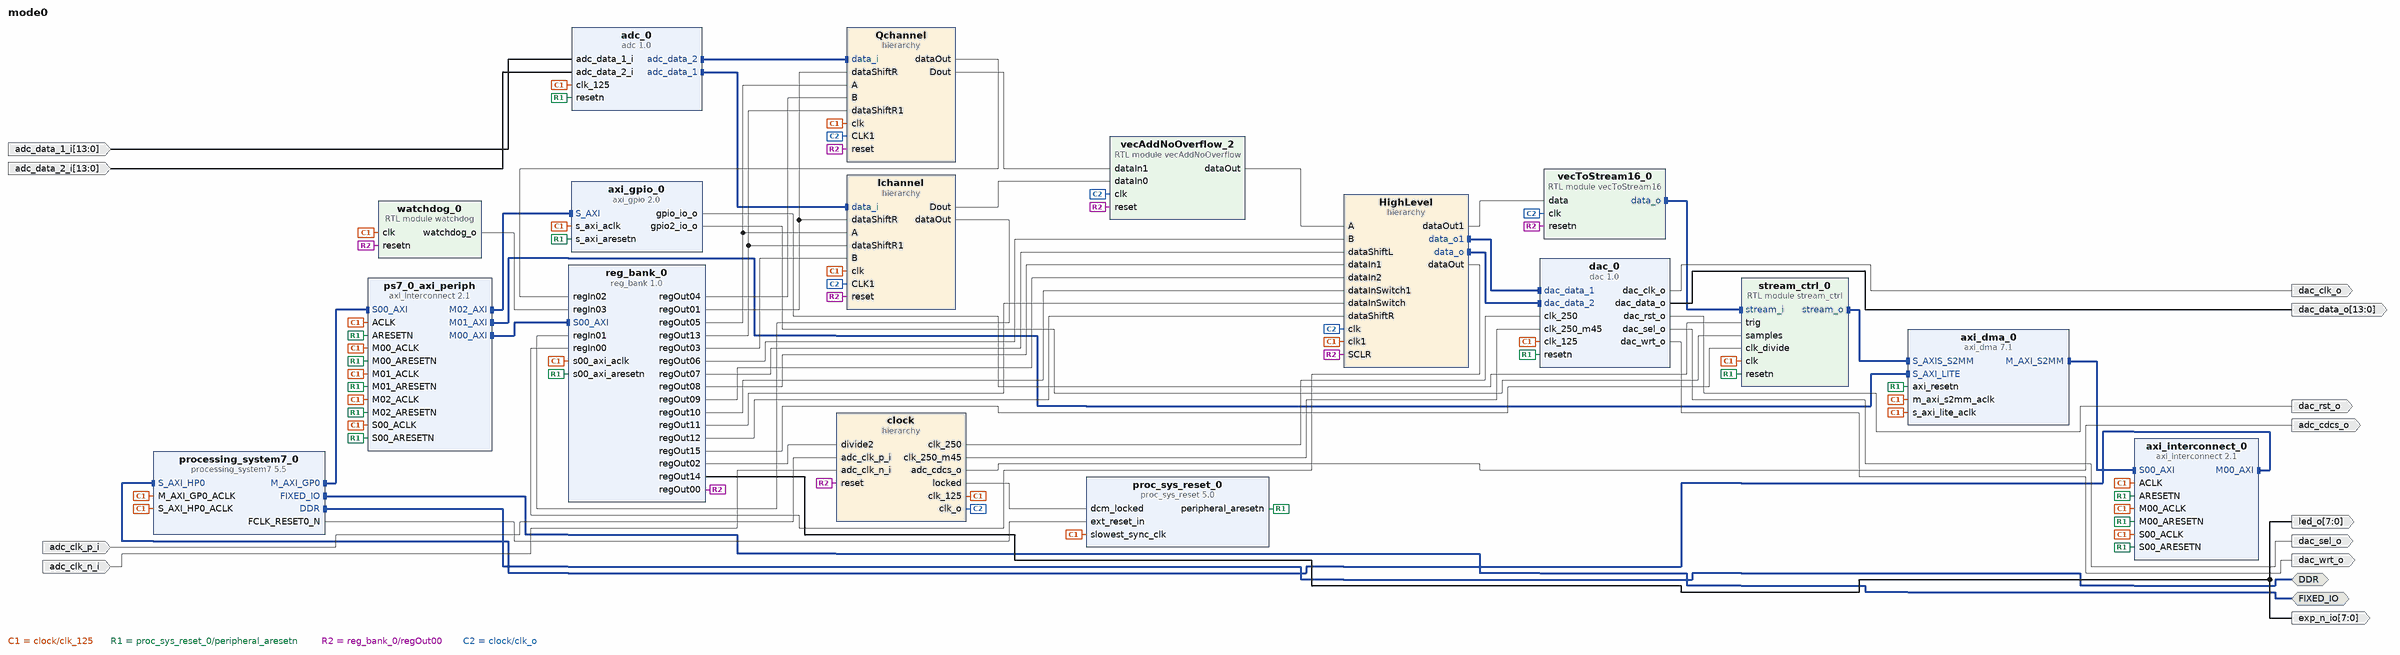
[diagram p0: block diagram of the top level]
# Vivado block design mode0, xc7z010clg400-1, Vivado 2020.2
create_bd_design mode0

create_bd_intf_port -mode Master -vlnv xilinx.com:interface:ddrx_rtl:1.0 DDR
create_bd_intf_port -mode Master -vlnv xilinx.com:display_processing_system7:fixedio_rtl:1.0 FIXED_IO
create_bd_port -dir I adc_clk_n_i
create_bd_port -dir I adc_clk_p_i
create_bd_port -dir I -from 13 -to 0 adc_data_1_i
create_bd_port -dir I -from 13 -to 0 adc_data_2_i
create_bd_port -dir O adc_cdcs_o
create_bd_port -dir O dac_clk_o
create_bd_port -dir O -from 13 -to 0 dac_data_o
create_bd_port -dir O dac_rst_o
create_bd_port -dir O dac_sel_o
create_bd_port -dir O dac_wrt_o
create_bd_port -dir O -from 7 -to 0 exp_n_io
create_bd_port -dir O -from 7 -to 0 led_o

create_bd_cell -type ip -vlnv DSPsandbox:FPGA-Notes-for-Scientist:reg_bank:1.0 reg_bank_0
set_property -dict [list \
  CONFIG.port_width_reg_out_00 1 \
  CONFIG.port_width_reg_out_01 5 \
  CONFIG.port_width_reg_out_02 5 \
  CONFIG.port_width_reg_out_05 10 \
  CONFIG.port_width_reg_out_07 5 \
  CONFIG.port_width_reg_out_10 1 \
  CONFIG.port_width_reg_out_11 1 \
  CONFIG.port_width_reg_out_12 5 \
  CONFIG.port_width_reg_out_13 5 \
  CONFIG.port_width_reg_out_14 8 \
  CONFIG.port_width_reg_out_15 8 \
  CONFIG.reg_in_enabled 4 \
  CONFIG.reg_out_enabled 16 \
] [get_bd_cells reg_bank_0]
create_bd_cell -type module -reference vecAddNoOverflow vecAddNoOverflow_2
create_bd_cell -type ip -vlnv xilinx.com:ip:processing_system7:5.5 processing_system7_0
set_property -dict [list \
  CONFIG.PCW_ENET0_ENET0_IO {MIO 16 .. 27} \
  CONFIG.PCW_ENET0_GRP_MDIO_ENABLE 1 \
  CONFIG.PCW_ENET0_GRP_MDIO_IO {MIO 52 .. 53} \
  CONFIG.PCW_ENET0_PERIPHERAL_ENABLE 1 \
  CONFIG.PCW_ENET0_RESET_ENABLE 0 \
  CONFIG.PCW_ENET_RESET_ENABLE 1 \
  CONFIG.PCW_ENET_RESET_SELECT {Share reset pin} \
  CONFIG.PCW_FPGA0_PERIPHERAL_FREQMHZ 50 \
  CONFIG.PCW_FPGA1_PERIPHERAL_FREQMHZ 50 \
  CONFIG.PCW_GPIO_MIO_GPIO_ENABLE 1 \
  CONFIG.PCW_GPIO_MIO_GPIO_IO MIO \
  CONFIG.PCW_I2C_RESET_ENABLE 1 \
  CONFIG.PCW_PRESET_BANK1_VOLTAGE {LVCMOS 2.5V} \
  CONFIG.PCW_QSPI_PERIPHERAL_ENABLE 0 \
  CONFIG.PCW_SD0_GRP_CD_ENABLE 1 \
  CONFIG.PCW_SD0_GRP_CD_IO {MIO 46} \
  CONFIG.PCW_SD0_GRP_WP_ENABLE 1 \
  CONFIG.PCW_SD0_GRP_WP_IO {MIO 47} \
  CONFIG.PCW_SD0_PERIPHERAL_ENABLE 1 \
  CONFIG.PCW_SD0_SD0_IO {MIO 40 .. 45} \
  CONFIG.PCW_SDIO_PERIPHERAL_FREQMHZ 100 \
  CONFIG.PCW_UART0_PERIPHERAL_ENABLE 1 \
  CONFIG.PCW_UART0_UART0_IO {MIO 14 .. 15} \
  CONFIG.PCW_UART1_PERIPHERAL_ENABLE 0 \
  CONFIG.PCW_UART_PERIPHERAL_FREQMHZ 100 \
  CONFIG.PCW_UIPARAM_DDR_BUS_WIDTH {16 Bit} \
  CONFIG.PCW_UIPARAM_DDR_PARTNO {MT41J256M16 RE-125} \
  CONFIG.PCW_USB0_PERIPHERAL_ENABLE 1 \
  CONFIG.PCW_USB0_RESET_ENABLE 1 \
  CONFIG.PCW_USB0_RESET_IO {MIO 48} \
  CONFIG.PCW_USB0_USB0_IO {MIO 28 .. 39} \
  CONFIG.PCW_USB_RESET_ENABLE 1 \
  CONFIG.PCW_USB_RESET_SELECT {Share reset pin} \
  CONFIG.PCW_USE_S_AXI_HP0 1 \
] [get_bd_cells processing_system7_0]
# 229 more settings of processing_system7_0 are not shown: defaults, MIO pin electricals, DDR timing, and values the tool derives
create_bd_cell -type ip -vlnv xilinx.com:ip:proc_sys_reset:5.0 proc_sys_reset_0
create_bd_cell -type ip -vlnv xilinx.com:ip:axi_interconnect:2.1 ps7_0_axi_periph
set_property -dict {CONFIG.NUM_MI 3} [get_bd_cells ps7_0_axi_periph]
create_bd_cell -type module -reference watchdog watchdog_0
create_bd_cell -type ip -vlnv DSPsandbox:FPGA-Notes-for-Scientist:dac:1.0 dac_0
create_bd_cell -type ip -vlnv DSPsandbox:FPGA-Notes-for-Scientists:adc:1.0 adc_0
create_bd_cell -type hier clock
create_bd_cell -type hier Ichannel
create_bd_cell -type hier Qchannel
create_bd_cell -type hier HighLevel
create_bd_cell -type ip -vlnv xilinx.com:ip:axi_gpio:2.0 axi_gpio_0
set_property -dict [list \
  CONFIG.C_ALL_OUTPUTS 1 \
  CONFIG.C_ALL_OUTPUTS_2 1 \
  CONFIG.C_GPIO_WIDTH 1 \
  CONFIG.C_IS_DUAL 1 \
] [get_bd_cells axi_gpio_0]
create_bd_cell -type ip -vlnv xilinx.com:ip:axi_interconnect:2.1 axi_interconnect_0
set_property -dict {CONFIG.NUM_MI 1} [get_bd_cells axi_interconnect_0]
create_bd_cell -type ip -vlnv xilinx.com:ip:axi_dma:7.1 axi_dma_0
set_property -dict [list \
  CONFIG.c_include_mm2s 0 \
  CONFIG.c_include_sg 0 \
  CONFIG.c_m_axi_s2mm_data_width 64 \
  CONFIG.c_s2mm_burst_size 64 \
  CONFIG.c_s_axis_s2mm_tdata_width 16 \
  CONFIG.c_sg_length_width 26 \
] [get_bd_cells axi_dma_0]
create_bd_cell -type module -reference vecToStream16 vecToStream16_0
create_bd_cell -type module -reference stream_ctrl stream_ctrl_0

# ---- hierarchy /clock ----
current_bd_instance /clock
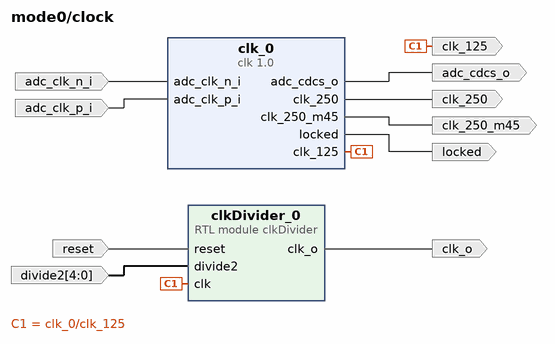
[diagram p1: block diagram inside /clock]
create_bd_pin -dir O -type clk clk_125
create_bd_pin -dir I -type rst reset
create_bd_pin -dir I -from 4 -to 0 divide2
create_bd_pin -dir O clk_o
create_bd_pin -dir O adc_cdcs_o
create_bd_pin -dir I adc_clk_n_i
create_bd_pin -dir I adc_clk_p_i
create_bd_pin -dir O -type clk clk_250
create_bd_pin -dir O -type clk clk_250_m45
create_bd_pin -dir O locked

create_bd_cell -type module -reference clkDivider clkDivider_0
create_bd_cell -type ip -vlnv DSPsandbox:FPGA-Notes-for-Scientists:clk:1.0 clk_0

# ---- hierarchy /Ichannel ----
current_bd_instance /Ichannel
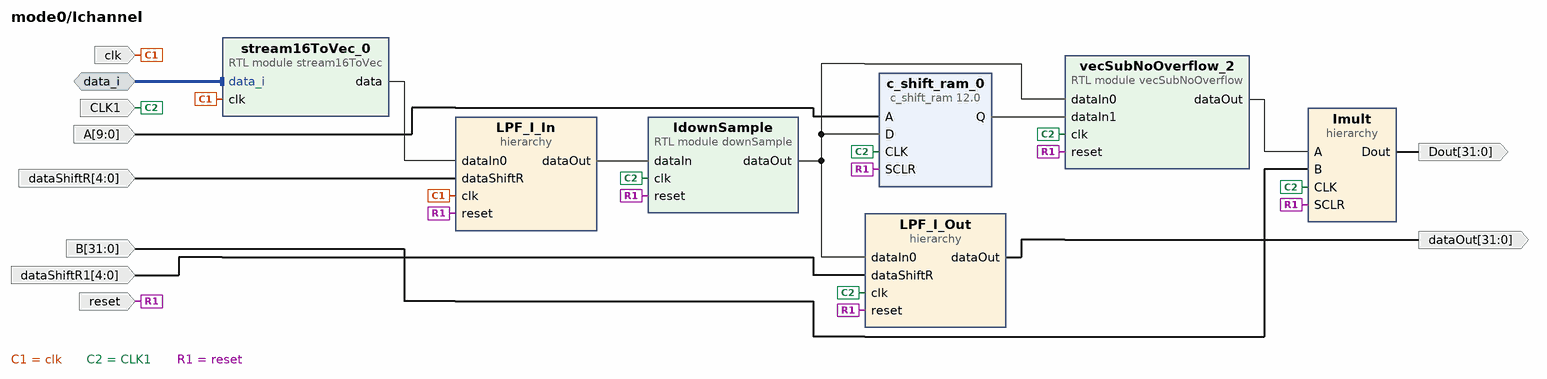
[diagram p2: block diagram inside /Ichannel]
create_bd_intf_pin -mode Slave -vlnv xilinx.com:interface:axis_rtl:1.0 data_i
create_bd_pin -dir I -type clk clk
create_bd_pin -dir I -from 9 -to 0 -type data A
create_bd_pin -dir I -type clk CLK1
create_bd_pin -dir I -type rst reset
create_bd_pin -dir I -from 4 -to 0 dataShiftR
create_bd_pin -dir I -from 31 -to 0 -type data B
create_bd_pin -dir O -from 31 -to 0 Dout
create_bd_pin -dir I -from 4 -to 0 dataShiftR1
create_bd_pin -dir O -from 31 -to 0 dataOut

create_bd_cell -type module -reference stream16ToVec stream16ToVec_0
create_bd_cell -type hier LPF_I_In
create_bd_cell -type hier Imult
create_bd_cell -type hier LPF_I_Out
create_bd_cell -type ip -vlnv xilinx.com:ip:c_shift_ram:12.0 c_shift_ram_0
set_property -dict [list \
  CONFIG.AsyncInitVal 00000000000000000000000000000000 \
  CONFIG.DefaultData 00000000000000000000000000000000 \
  CONFIG.Depth 1024 \
  CONFIG.SCLR true \
  CONFIG.ShiftRegType Variable_Length_Lossless \
  CONFIG.Width 32 \
] [get_bd_cells c_shift_ram_0]
create_bd_cell -type module -reference downSample IdownSample
create_bd_cell -type module -reference vecSubNoOverflow vecSubNoOverflow_2

# ---- hierarchy /Ichannel/LPF_I_In ----
current_bd_instance /Ichannel/LPF_I_In
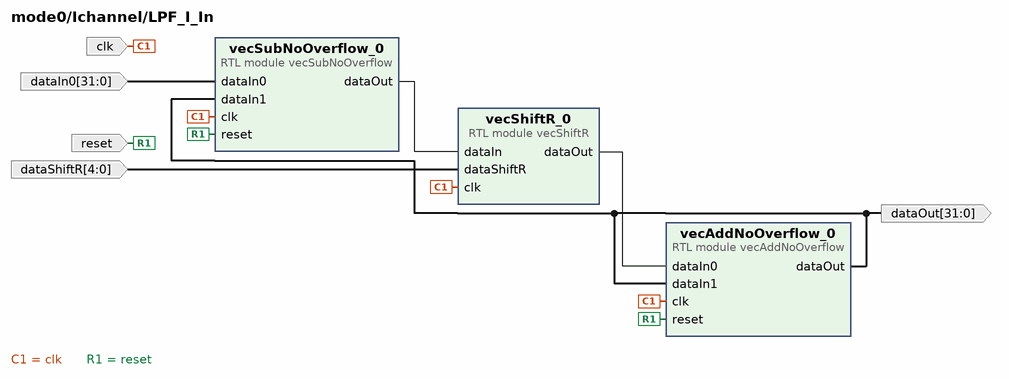
[diagram p3: block diagram inside /Ichannel/LPF_I_In]
create_bd_pin -dir I -type clk clk
create_bd_pin -dir I -from 4 -to 0 dataShiftR
create_bd_pin -dir I -type rst reset
create_bd_pin -dir I -from 31 -to 0 dataIn0
create_bd_pin -dir O -from 31 -to 0 dataOut

create_bd_cell -type module -reference vecShiftR vecShiftR_0
create_bd_cell -type module -reference vecSubNoOverflow vecSubNoOverflow_0
create_bd_cell -type module -reference vecAddNoOverflow vecAddNoOverflow_0

# ---- hierarchy /Ichannel/Imult ----
current_bd_instance /Ichannel/Imult
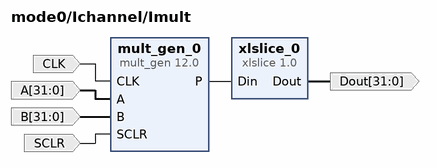
[diagram p4: block diagram inside /Ichannel/Imult]
create_bd_pin -dir I -type clk CLK
create_bd_pin -dir I -from 31 -to 0 -type data A
create_bd_pin -dir I -from 31 -to 0 -type data B
create_bd_pin -dir I -type rst SCLR
create_bd_pin -dir O -from 31 -to 0 Dout

create_bd_cell -type ip -vlnv xilinx.com:ip:mult_gen:12.0 mult_gen_0
set_property -dict [list \
  CONFIG.OutputWidthHigh 63 \
  CONFIG.PortAWidth 32 \
  CONFIG.PortBWidth 32 \
  CONFIG.SyncClear true \
  CONFIG.Use_Custom_Output_Width true \
] [get_bd_cells mult_gen_0]
create_bd_cell -type ip -vlnv xilinx.com:ip:xlslice:1.0 xlslice_0
set_property -dict {CONFIG.DIN_FROM 63 CONFIG.DIN_TO 32 CONFIG.DIN_WIDTH 64 CONFIG.DOUT_WIDTH 32} [get_bd_cells xlslice_0]

# ---- hierarchy /Ichannel/LPF_I_Out ----
current_bd_instance /Ichannel/LPF_I_Out
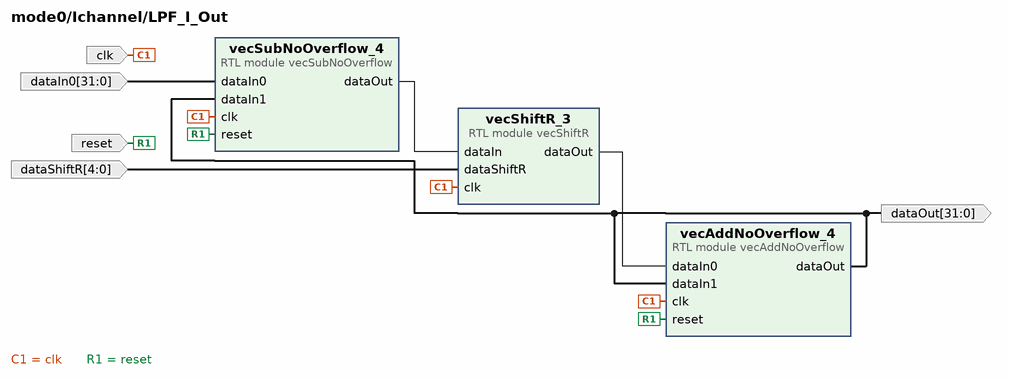
[diagram p5: block diagram inside /Ichannel/LPF_I_Out]
create_bd_pin -dir I -type clk clk
create_bd_pin -dir I -from 4 -to 0 dataShiftR
create_bd_pin -dir I -type rst reset
create_bd_pin -dir O -from 31 -to 0 dataOut
create_bd_pin -dir I -from 31 -to 0 dataIn0

create_bd_cell -type module -reference vecShiftR vecShiftR_3
create_bd_cell -type module -reference vecAddNoOverflow vecAddNoOverflow_4
create_bd_cell -type module -reference vecSubNoOverflow vecSubNoOverflow_4

# ---- hierarchy /Qchannel ----
current_bd_instance /Qchannel
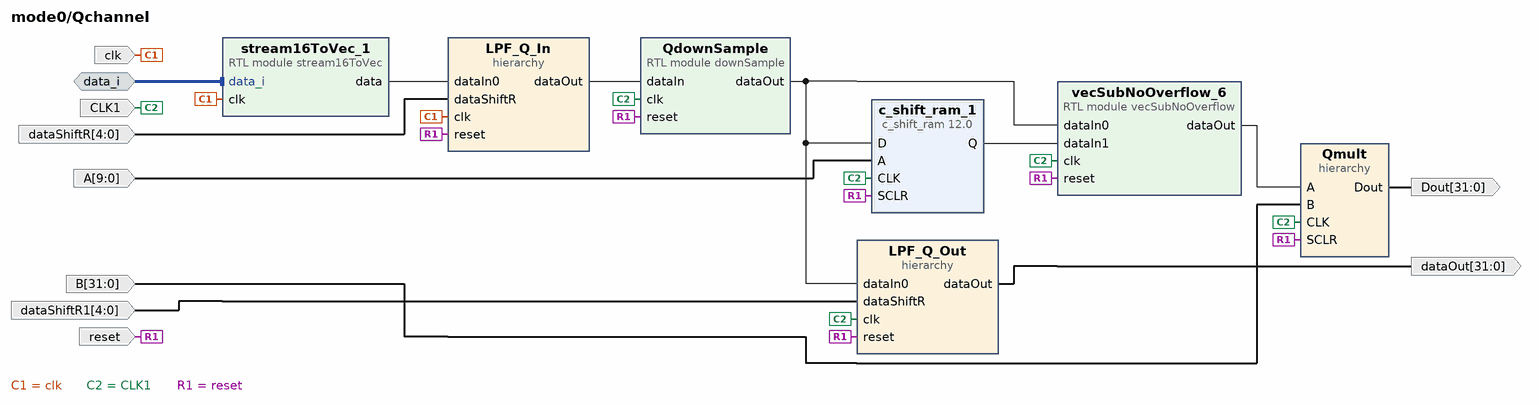
[diagram p6: block diagram inside /Qchannel]
create_bd_intf_pin -mode Slave -vlnv xilinx.com:interface:axis_rtl:1.0 data_i
create_bd_pin -dir I -type clk clk
create_bd_pin -dir I -type clk CLK1
create_bd_pin -dir I -type rst reset
create_bd_pin -dir I -from 9 -to 0 -type data A
create_bd_pin -dir I -from 4 -to 0 dataShiftR
create_bd_pin -dir I -from 31 -to 0 -type data B
create_bd_pin -dir O -from 31 -to 0 Dout
create_bd_pin -dir I -from 4 -to 0 dataShiftR1
create_bd_pin -dir O -from 31 -to 0 dataOut

create_bd_cell -type module -reference stream16ToVec stream16ToVec_1
create_bd_cell -type hier LPF_Q_In
create_bd_cell -type hier Qmult
create_bd_cell -type hier LPF_Q_Out
create_bd_cell -type module -reference downSample QdownSample
create_bd_cell -type ip -vlnv xilinx.com:ip:c_shift_ram:12.0 c_shift_ram_1
set_property -dict [list \
  CONFIG.AsyncInitVal 00000000000000000000000000000000 \
  CONFIG.DefaultData 00000000000000000000000000000000 \
  CONFIG.Depth 1024 \
  CONFIG.SCLR true \
  CONFIG.ShiftRegType Variable_Length_Lossless \
  CONFIG.Width 32 \
] [get_bd_cells c_shift_ram_1]
create_bd_cell -type module -reference vecSubNoOverflow vecSubNoOverflow_6

# ---- hierarchy /Qchannel/LPF_Q_In ----
current_bd_instance /Qchannel/LPF_Q_In
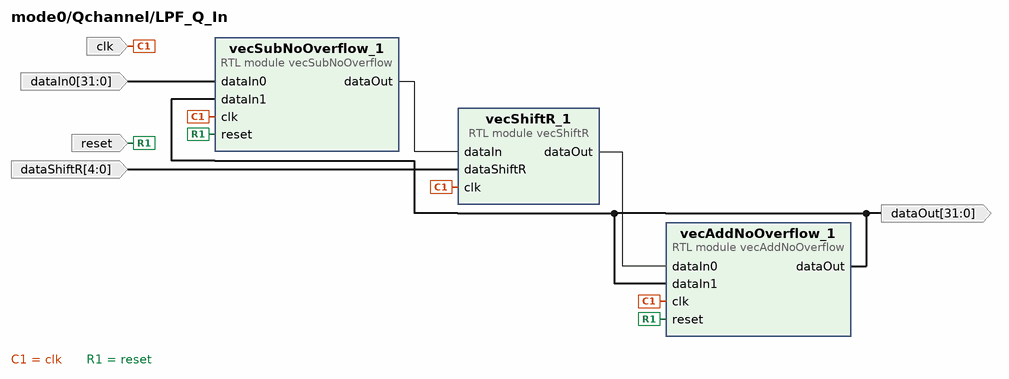
[diagram p7: block diagram inside /Qchannel/LPF_Q_In]
create_bd_pin -dir I -type clk clk
create_bd_pin -dir I -from 4 -to 0 dataShiftR
create_bd_pin -dir I -type rst reset
create_bd_pin -dir I -from 31 -to 0 dataIn0
create_bd_pin -dir O -from 31 -to 0 dataOut

create_bd_cell -type module -reference vecShiftR vecShiftR_1
create_bd_cell -type module -reference vecSubNoOverflow vecSubNoOverflow_1
create_bd_cell -type module -reference vecAddNoOverflow vecAddNoOverflow_1

# ---- hierarchy /Qchannel/Qmult ----
current_bd_instance /Qchannel/Qmult
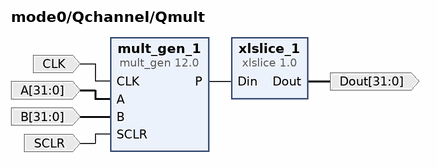
[diagram p8: block diagram inside /Qchannel/Qmult]
create_bd_pin -dir I -type clk CLK
create_bd_pin -dir I -from 31 -to 0 -type data A
create_bd_pin -dir I -from 31 -to 0 -type data B
create_bd_pin -dir I -type rst SCLR
create_bd_pin -dir O -from 31 -to 0 Dout

create_bd_cell -type ip -vlnv xilinx.com:ip:mult_gen:12.0 mult_gen_1
set_property -dict [list \
  CONFIG.OutputWidthHigh 63 \
  CONFIG.PortAWidth 32 \
  CONFIG.PortBWidth 32 \
  CONFIG.SyncClear true \
  CONFIG.Use_Custom_Output_Width true \
] [get_bd_cells mult_gen_1]
create_bd_cell -type ip -vlnv xilinx.com:ip:xlslice:1.0 xlslice_1
set_property -dict {CONFIG.DIN_FROM 63 CONFIG.DIN_TO 32 CONFIG.DIN_WIDTH 64 CONFIG.DOUT_WIDTH 32} [get_bd_cells xlslice_1]

# ---- hierarchy /Qchannel/LPF_Q_Out ----
current_bd_instance /Qchannel/LPF_Q_Out
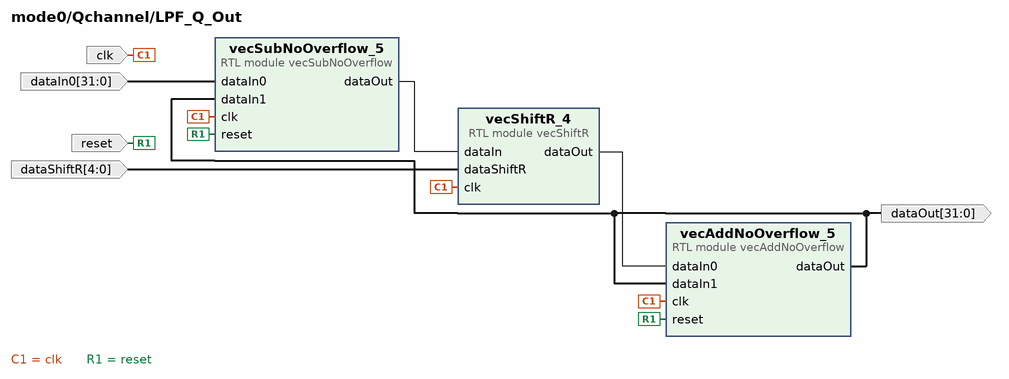
[diagram p9: block diagram inside /Qchannel/LPF_Q_Out]
create_bd_pin -dir I -type clk clk
create_bd_pin -dir I -from 4 -to 0 dataShiftR
create_bd_pin -dir I -type rst reset
create_bd_pin -dir O -from 31 -to 0 dataOut
create_bd_pin -dir I -from 31 -to 0 dataIn0

create_bd_cell -type module -reference vecShiftR vecShiftR_4
create_bd_cell -type module -reference vecAddNoOverflow vecAddNoOverflow_5
create_bd_cell -type module -reference vecSubNoOverflow vecSubNoOverflow_5

# ---- hierarchy /HighLevel ----
current_bd_instance /HighLevel
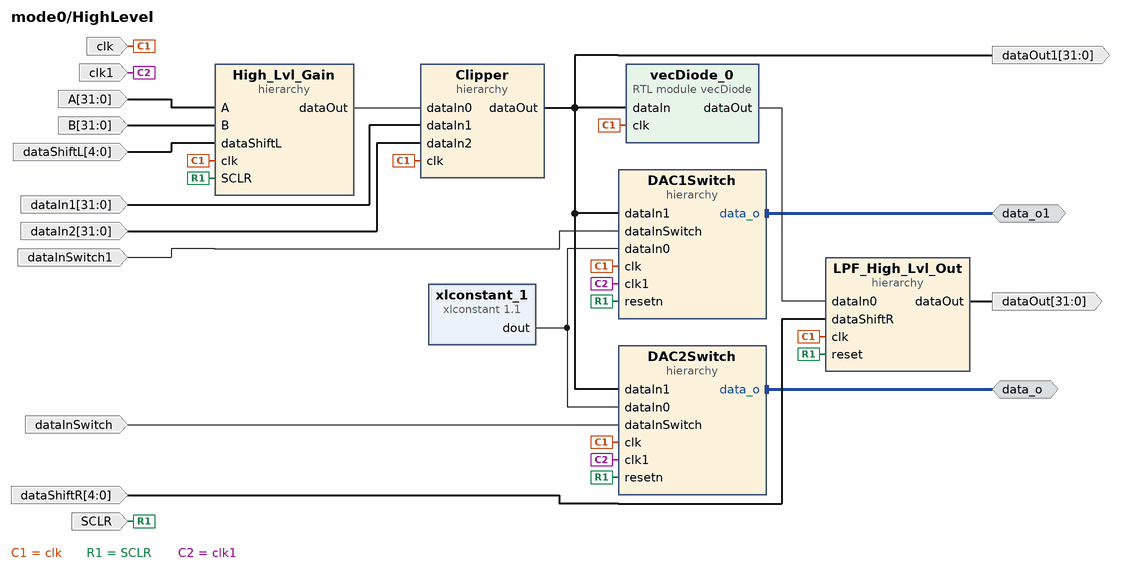
[diagram p10: block diagram inside /HighLevel]
create_bd_intf_pin -mode Master -vlnv xilinx.com:interface:axis_rtl:1.0 data_o
create_bd_intf_pin -mode Master -vlnv xilinx.com:interface:axis_rtl:1.0 data_o1
create_bd_pin -dir I -type clk clk
create_bd_pin -dir I -from 4 -to 0 dataShiftR
create_bd_pin -dir I -type rst SCLR
create_bd_pin -dir O -from 31 -to 0 dataOut
create_bd_pin -dir I -from 31 -to 0 dataIn1
create_bd_pin -dir I -from 31 -to 0 dataIn2
create_bd_pin -dir I -from 31 -to 0 -type data A
create_bd_pin -dir I -from 31 -to 0 -type data B
create_bd_pin -dir I -from 4 -to 0 dataShiftL
create_bd_pin -dir I dataInSwitch
create_bd_pin -dir I -type clk clk1
create_bd_pin -dir I dataInSwitch1
create_bd_pin -dir O -from 31 -to 0 dataOut1

create_bd_cell -type ip -vlnv xilinx.com:ip:xlconstant:1.1 xlconstant_1
set_property -dict {CONFIG.CONST_VAL 0 CONFIG.CONST_WIDTH 32} [get_bd_cells xlconstant_1]
create_bd_cell -type module -reference vecDiode vecDiode_0
create_bd_cell -type hier LPF_High_Lvl_Out
create_bd_cell -type hier Clipper
create_bd_cell -type hier High_Lvl_Gain
create_bd_cell -type hier DAC2Switch
create_bd_cell -type hier DAC1Switch

# ---- hierarchy /HighLevel/LPF_High_Lvl_Out ----
current_bd_instance /HighLevel/LPF_High_Lvl_Out
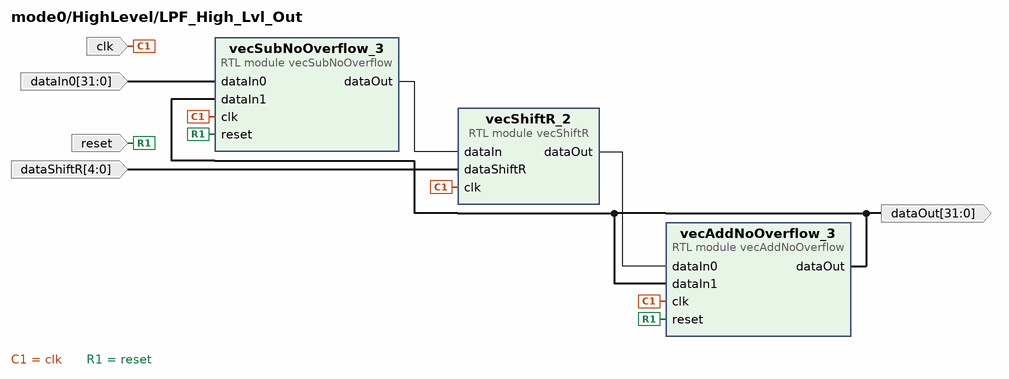
[diagram p11: block diagram inside /HighLevel/LPF_High_Lvl_Out]
create_bd_pin -dir I -type clk clk
create_bd_pin -dir I -from 4 -to 0 dataShiftR
create_bd_pin -dir I -type rst reset
create_bd_pin -dir I -from 31 -to 0 dataIn0
create_bd_pin -dir O -from 31 -to 0 dataOut

create_bd_cell -type module -reference vecShiftR vecShiftR_2
create_bd_cell -type module -reference vecSubNoOverflow vecSubNoOverflow_3
create_bd_cell -type module -reference vecAddNoOverflow vecAddNoOverflow_3

# ---- hierarchy /HighLevel/Clipper ----
current_bd_instance /HighLevel/Clipper
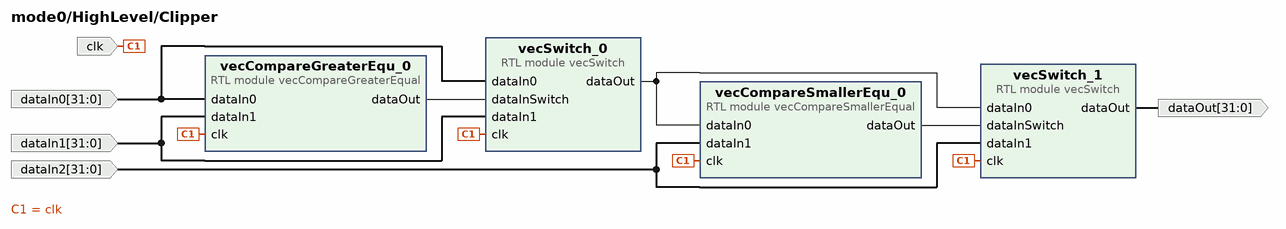
[diagram p12: block diagram inside /HighLevel/Clipper]
create_bd_pin -dir I -type clk clk
create_bd_pin -dir I -from 31 -to 0 dataIn0
create_bd_pin -dir I -from 31 -to 0 dataIn1
create_bd_pin -dir I -from 31 -to 0 dataIn2
create_bd_pin -dir O -from 31 -to 0 dataOut

create_bd_cell -type module -reference vecSwitch vecSwitch_0
create_bd_cell -type module -reference vecCompareGreaterEqual vecCompareGreaterEqu_0
create_bd_cell -type module -reference vecCompareSmallerEqual vecCompareSmallerEqu_0
create_bd_cell -type module -reference vecSwitch vecSwitch_1

# ---- hierarchy /HighLevel/High_Lvl_Gain ----
current_bd_instance /HighLevel/High_Lvl_Gain
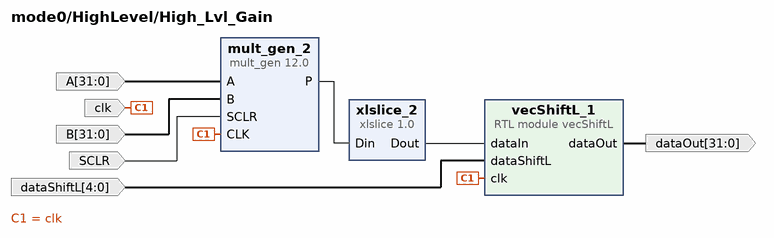
[diagram p13: block diagram inside /HighLevel/High_Lvl_Gain]
create_bd_pin -dir I -type clk clk
create_bd_pin -dir I -from 31 -to 0 -type data A
create_bd_pin -dir I -from 31 -to 0 -type data B
create_bd_pin -dir I -type rst SCLR
create_bd_pin -dir I -from 4 -to 0 dataShiftL
create_bd_pin -dir O -from 31 -to 0 dataOut

create_bd_cell -type ip -vlnv xilinx.com:ip:xlslice:1.0 xlslice_2
set_property -dict {CONFIG.DIN_FROM 63 CONFIG.DIN_TO 32 CONFIG.DIN_WIDTH 64 CONFIG.DOUT_WIDTH 32} [get_bd_cells xlslice_2]
create_bd_cell -type ip -vlnv xilinx.com:ip:mult_gen:12.0 mult_gen_2
set_property -dict [list \
  CONFIG.OutputWidthHigh 63 \
  CONFIG.PortAWidth 32 \
  CONFIG.PortBWidth 32 \
  CONFIG.SyncClear true \
  CONFIG.Use_Custom_Output_Width true \
] [get_bd_cells mult_gen_2]
create_bd_cell -type module -reference vecShiftL vecShiftL_1

# ---- hierarchy /HighLevel/DAC2Switch ----
current_bd_instance /HighLevel/DAC2Switch
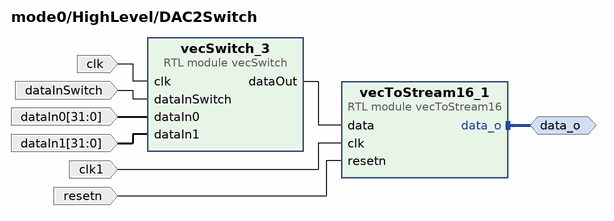
[diagram p14: block diagram inside /HighLevel/DAC2Switch]
create_bd_intf_pin -mode Master -vlnv xilinx.com:interface:axis_rtl:1.0 data_o
create_bd_pin -dir I -type clk clk
create_bd_pin -dir I dataInSwitch
create_bd_pin -dir I -from 31 -to 0 dataIn0
create_bd_pin -dir I -from 31 -to 0 dataIn1
create_bd_pin -dir I -type clk clk1
create_bd_pin -dir I -type rst resetn

create_bd_cell -type module -reference vecSwitch vecSwitch_3
create_bd_cell -type module -reference vecToStream16 vecToStream16_1

# ---- hierarchy /HighLevel/DAC1Switch ----
current_bd_instance /HighLevel/DAC1Switch
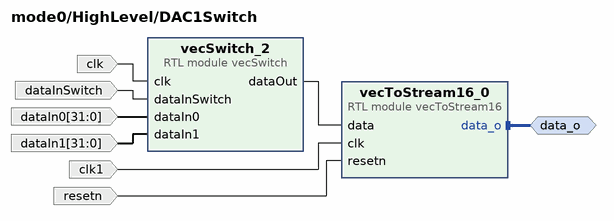
[diagram p15: block diagram inside /HighLevel/DAC1Switch]
create_bd_intf_pin -mode Master -vlnv xilinx.com:interface:axis_rtl:1.0 data_o
create_bd_pin -dir I -type clk clk
create_bd_pin -dir I dataInSwitch
create_bd_pin -dir I -from 31 -to 0 dataIn0
create_bd_pin -dir I -from 31 -to 0 dataIn1
create_bd_pin -dir I -type clk clk1
create_bd_pin -dir I -type rst resetn

create_bd_cell -type module -reference vecSwitch vecSwitch_2
create_bd_cell -type module -reference vecToStream16 vecToStream16_0

# ---- connections ----

current_bd_instance /clock
connect_bd_net [get_bd_pins clk_0/clk_125] [get_bd_pins clk_125] [get_bd_pins clkDivider_0/clk]
connect_bd_net -net reg_bank_0_regOut00 [get_bd_pins reset] [get_bd_pins clkDivider_0/reset]
connect_bd_net -net reg_bank_0_regOut02 [get_bd_pins divide2] [get_bd_pins clkDivider_0/divide2]
connect_bd_net [get_bd_pins clkDivider_0/clk_o] [get_bd_pins clk_o]
connect_bd_net [get_bd_pins clk_0/adc_cdcs_o] [get_bd_pins adc_cdcs_o]
connect_bd_net [get_bd_pins adc_clk_n_i] [get_bd_pins clk_0/adc_clk_n_i]
connect_bd_net [get_bd_pins adc_clk_p_i] [get_bd_pins clk_0/adc_clk_p_i]
connect_bd_net [get_bd_pins clk_0/clk_250] [get_bd_pins clk_250]
connect_bd_net [get_bd_pins clk_0/clk_250_m45] [get_bd_pins clk_250_m45]
connect_bd_net [get_bd_pins clk_0/locked] [get_bd_pins locked]

current_bd_instance /Ichannel
connect_bd_intf_net -intf_net adc_0_adc_data_1 [get_bd_intf_pins data_i] [get_bd_intf_pins stream16ToVec_0/data_i]
connect_bd_net -net adc_data1 [get_bd_pins stream16ToVec_0/data] [get_bd_pins LPF_I_In/dataIn0]
connect_bd_net -net clk_0_clk_125 [get_bd_pins clk] [get_bd_pins LPF_I_In/clk] [get_bd_pins stream16ToVec_0/clk]
connect_bd_net -net reg_bank_0_regOut05 [get_bd_pins A] [get_bd_pins c_shift_ram_0/A]
connect_bd_net -net clkDivider_0_clk_o [get_bd_pins CLK1] \
  [get_bd_pins Imult/CLK] [get_bd_pins LPF_I_Out/clk] [get_bd_pins IdownSample/clk] [get_bd_pins c_shift_ram_0/CLK] \
  [get_bd_pins vecSubNoOverflow_2/clk]
connect_bd_net -net reg_bank_0_regOut00 [get_bd_pins reset] \
  [get_bd_pins LPF_I_In/reset] [get_bd_pins Imult/SCLR] [get_bd_pins LPF_I_Out/reset] [get_bd_pins IdownSample/reset] \
  [get_bd_pins c_shift_ram_0/SCLR] [get_bd_pins vecSubNoOverflow_2/reset]
connect_bd_net -net reg_bank_0_regOut01 [get_bd_pins dataShiftR] [get_bd_pins LPF_I_In/dataShiftR]
connect_bd_net -net reg_bank_0_regOut03 [get_bd_pins B] [get_bd_pins Imult/B]
connect_bd_net -net Imult1_Dout [get_bd_pins Imult/Dout] [get_bd_pins Dout]
connect_bd_net -net reg_bank_0_regOut13 [get_bd_pins dataShiftR1] [get_bd_pins LPF_I_Out/dataShiftR]
connect_bd_net -net Ichannel_dataOut [get_bd_pins LPF_I_Out/dataOut] [get_bd_pins dataOut]
connect_bd_net [get_bd_pins IdownSample/dataOut] \
  [get_bd_pins c_shift_ram_0/D] [get_bd_pins LPF_I_Out/dataIn0] [get_bd_pins vecSubNoOverflow_2/dataIn0]
connect_bd_net [get_bd_pins LPF_I_In/dataOut] [get_bd_pins IdownSample/dataIn]
connect_bd_net [get_bd_pins c_shift_ram_0/Q] [get_bd_pins vecSubNoOverflow_2/dataIn1]
connect_bd_net -net A_1 [get_bd_pins vecSubNoOverflow_2/dataOut] [get_bd_pins Imult/A]

current_bd_instance /Ichannel/LPF_I_In
connect_bd_net [get_bd_pins vecSubNoOverflow_0/dataOut] [get_bd_pins vecShiftR_0/dataIn]
connect_bd_net [get_bd_pins vecShiftR_0/dataOut] [get_bd_pins vecAddNoOverflow_0/dataIn0]
connect_bd_net -net clk_0_clk_125 [get_bd_pins clk] \
  [get_bd_pins vecSubNoOverflow_0/clk] [get_bd_pins vecAddNoOverflow_0/clk] [get_bd_pins vecShiftR_0/clk]
connect_bd_net -net reg_bank_0_regOut01 [get_bd_pins dataShiftR] [get_bd_pins vecShiftR_0/dataShiftR]
connect_bd_net -net reg_bank_0_regOut00 [get_bd_pins reset] [get_bd_pins vecAddNoOverflow_0/reset] [get_bd_pins vecSubNoOverflow_0/reset]
connect_bd_net -net adc_data1 [get_bd_pins dataIn0] [get_bd_pins vecSubNoOverflow_0/dataIn0]
connect_bd_net [get_bd_pins vecAddNoOverflow_0/dataOut] \
  [get_bd_pins dataOut] [get_bd_pins vecAddNoOverflow_0/dataIn1] [get_bd_pins vecSubNoOverflow_0/dataIn1]

current_bd_instance /Ichannel/Imult
connect_bd_net [get_bd_pins mult_gen_0/P] [get_bd_pins xlslice_0/Din]
connect_bd_net -net clkDivider_0_clk_o [get_bd_pins CLK] [get_bd_pins mult_gen_0/CLK]
connect_bd_net -net Notch1_dataOut [get_bd_pins A] [get_bd_pins mult_gen_0/A]
connect_bd_net -net reg_bank_0_regOut03 [get_bd_pins B] [get_bd_pins mult_gen_0/B]
connect_bd_net -net reg_bank_0_regOut00 [get_bd_pins SCLR] [get_bd_pins mult_gen_0/SCLR]
connect_bd_net -net Imult1_Dout [get_bd_pins xlslice_0/Dout] [get_bd_pins Dout]

current_bd_instance /Ichannel/LPF_I_Out
connect_bd_net [get_bd_pins vecSubNoOverflow_4/dataOut] [get_bd_pins vecShiftR_3/dataIn]
connect_bd_net [get_bd_pins vecShiftR_3/dataOut] [get_bd_pins vecAddNoOverflow_4/dataIn0]
connect_bd_net -net clkDivider_0_clk_o [get_bd_pins clk] \
  [get_bd_pins vecSubNoOverflow_4/clk] [get_bd_pins vecAddNoOverflow_4/clk] [get_bd_pins vecShiftR_3/clk]
connect_bd_net -net reg_bank_0_regOut13 [get_bd_pins dataShiftR] [get_bd_pins vecShiftR_3/dataShiftR]
connect_bd_net -net reg_bank_0_regOut00 [get_bd_pins reset] [get_bd_pins vecSubNoOverflow_4/reset] [get_bd_pins vecAddNoOverflow_4/reset]
connect_bd_net -net Ichannel_dataOut [get_bd_pins vecAddNoOverflow_4/dataOut] \
  [get_bd_pins dataOut] [get_bd_pins vecSubNoOverflow_4/dataIn1] [get_bd_pins vecAddNoOverflow_4/dataIn1]
connect_bd_net -net downSample_0_dataOut [get_bd_pins dataIn0] [get_bd_pins vecSubNoOverflow_4/dataIn0]

current_bd_instance /Qchannel
connect_bd_intf_net -intf_net adc_0_adc_data_2 [get_bd_intf_pins data_i] [get_bd_intf_pins stream16ToVec_1/data_i]
connect_bd_net -net adc_data [get_bd_pins stream16ToVec_1/data] [get_bd_pins LPF_Q_In/dataIn0]
connect_bd_net -net vecAddNoOverflow_1_dataOut [get_bd_pins LPF_Q_In/dataOut] [get_bd_pins QdownSample/dataIn]
connect_bd_net -net downSample_1_dataOut [get_bd_pins QdownSample/dataOut] \
  [get_bd_pins LPF_Q_Out/dataIn0] [get_bd_pins vecSubNoOverflow_6/dataIn0] [get_bd_pins c_shift_ram_1/D]
connect_bd_net -net Notch2_dataOut [get_bd_pins vecSubNoOverflow_6/dataOut] [get_bd_pins Qmult/A]
connect_bd_net -net clk_0_clk_125 [get_bd_pins clk] [get_bd_pins LPF_Q_In/clk] [get_bd_pins stream16ToVec_1/clk]
connect_bd_net -net clkDivider_0_clk_o [get_bd_pins CLK1] \
  [get_bd_pins Qmult/CLK] [get_bd_pins LPF_Q_Out/clk] [get_bd_pins vecSubNoOverflow_6/clk] [get_bd_pins c_shift_ram_1/CLK] \
  [get_bd_pins QdownSample/clk]
connect_bd_net -net reg_bank_0_regOut00 [get_bd_pins reset] \
  [get_bd_pins LPF_Q_In/reset] [get_bd_pins Qmult/SCLR] [get_bd_pins LPF_Q_Out/reset] [get_bd_pins vecSubNoOverflow_6/reset] \
  [get_bd_pins c_shift_ram_1/SCLR] [get_bd_pins QdownSample/reset]
connect_bd_net -net reg_bank_0_regOut05 [get_bd_pins A] [get_bd_pins c_shift_ram_1/A]
connect_bd_net -net reg_bank_0_regOut01 [get_bd_pins dataShiftR] [get_bd_pins LPF_Q_In/dataShiftR]
connect_bd_net -net reg_bank_0_regOut04 [get_bd_pins B] [get_bd_pins Qmult/B]
connect_bd_net -net Qmult1_Dout [get_bd_pins Qmult/Dout] [get_bd_pins Dout]
connect_bd_net -net reg_bank_0_regOut13 [get_bd_pins dataShiftR1] [get_bd_pins LPF_Q_Out/dataShiftR]
connect_bd_net -net Qchannel_dataOut [get_bd_pins LPF_Q_Out/dataOut] [get_bd_pins dataOut]
connect_bd_net -net c_shift_ram_0_Q_1 [get_bd_pins c_shift_ram_1/Q] [get_bd_pins vecSubNoOverflow_6/dataIn1]

current_bd_instance /Qchannel/LPF_Q_In
connect_bd_net [get_bd_pins vecSubNoOverflow_1/dataOut] [get_bd_pins vecShiftR_1/dataIn]
connect_bd_net [get_bd_pins vecShiftR_1/dataOut] [get_bd_pins vecAddNoOverflow_1/dataIn0]
connect_bd_net -net clk_0_clk_125 [get_bd_pins clk] \
  [get_bd_pins vecSubNoOverflow_1/clk] [get_bd_pins vecAddNoOverflow_1/clk] [get_bd_pins vecShiftR_1/clk]
connect_bd_net -net reg_bank_0_regOut01 [get_bd_pins dataShiftR] [get_bd_pins vecShiftR_1/dataShiftR]
connect_bd_net -net reg_bank_0_regOut00 [get_bd_pins reset] [get_bd_pins vecAddNoOverflow_1/reset] [get_bd_pins vecSubNoOverflow_1/reset]
connect_bd_net -net adc_data [get_bd_pins dataIn0] [get_bd_pins vecSubNoOverflow_1/dataIn0]
connect_bd_net [get_bd_pins vecAddNoOverflow_1/dataOut] \
  [get_bd_pins dataOut] [get_bd_pins vecAddNoOverflow_1/dataIn1] [get_bd_pins vecSubNoOverflow_1/dataIn1]

current_bd_instance /Qchannel/Qmult
connect_bd_net [get_bd_pins mult_gen_1/P] [get_bd_pins xlslice_1/Din]
connect_bd_net -net clkDivider_0_clk_o [get_bd_pins CLK] [get_bd_pins mult_gen_1/CLK]
connect_bd_net -net Notch2_dataOut [get_bd_pins A] [get_bd_pins mult_gen_1/A]
connect_bd_net -net reg_bank_0_regOut04 [get_bd_pins B] [get_bd_pins mult_gen_1/B]
connect_bd_net -net reg_bank_0_regOut00 [get_bd_pins SCLR] [get_bd_pins mult_gen_1/SCLR]
connect_bd_net -net Qmult1_Dout [get_bd_pins xlslice_1/Dout] [get_bd_pins Dout]

current_bd_instance /Qchannel/LPF_Q_Out
connect_bd_net [get_bd_pins vecSubNoOverflow_5/dataOut] [get_bd_pins vecShiftR_4/dataIn]
connect_bd_net [get_bd_pins vecShiftR_4/dataOut] [get_bd_pins vecAddNoOverflow_5/dataIn0]
connect_bd_net -net clkDivider_0_clk_o [get_bd_pins clk] \
  [get_bd_pins vecSubNoOverflow_5/clk] [get_bd_pins vecAddNoOverflow_5/clk] [get_bd_pins vecShiftR_4/clk]
connect_bd_net -net reg_bank_0_regOut13 [get_bd_pins dataShiftR] [get_bd_pins vecShiftR_4/dataShiftR]
connect_bd_net -net reg_bank_0_regOut00 [get_bd_pins reset] [get_bd_pins vecSubNoOverflow_5/reset] [get_bd_pins vecAddNoOverflow_5/reset]
connect_bd_net -net Qchannel_dataOut [get_bd_pins vecAddNoOverflow_5/dataOut] \
  [get_bd_pins dataOut] [get_bd_pins vecSubNoOverflow_5/dataIn1] [get_bd_pins vecAddNoOverflow_5/dataIn1]
connect_bd_net -net downSample_1_dataOut [get_bd_pins dataIn0] [get_bd_pins vecSubNoOverflow_5/dataIn0]

current_bd_instance /HighLevel
connect_bd_intf_net -intf_net vecToStream16_0_data_o [get_bd_intf_pins data_o1] [get_bd_intf_pins DAC1Switch/data_o]
connect_bd_intf_net -intf_net vecToStream16_1_data_o [get_bd_intf_pins data_o] [get_bd_intf_pins DAC2Switch/data_o]
connect_bd_net [get_bd_pins xlconstant_1/dout] [get_bd_pins DAC2Switch/dataIn0] [get_bd_pins DAC1Switch/dataIn0]
connect_bd_net -net vecSwitch_1_dataOut [get_bd_pins Clipper/dataOut] \
  [get_bd_pins vecDiode_0/dataIn] [get_bd_pins DAC2Switch/dataIn1] [get_bd_pins DAC1Switch/dataIn1] [get_bd_pins dataOut1]
connect_bd_net [get_bd_pins vecDiode_0/dataOut] [get_bd_pins LPF_High_Lvl_Out/dataIn0]
connect_bd_net [get_bd_pins High_Lvl_Gain/dataOut] [get_bd_pins Clipper/dataIn0]
connect_bd_net -net clkDivider_0_clk_o [get_bd_pins clk] \
  [get_bd_pins LPF_High_Lvl_Out/clk] [get_bd_pins High_Lvl_Gain/clk] [get_bd_pins Clipper/clk] [get_bd_pins DAC2Switch/clk] \
  [get_bd_pins DAC1Switch/clk] [get_bd_pins vecDiode_0/clk]
connect_bd_net -net reg_bank_0_regOut12 [get_bd_pins dataShiftR] [get_bd_pins LPF_High_Lvl_Out/dataShiftR]
connect_bd_net -net reg_bank_0_regOut00 [get_bd_pins SCLR] \
  [get_bd_pins High_Lvl_Gain/SCLR] [get_bd_pins DAC2Switch/resetn] [get_bd_pins DAC1Switch/resetn] \
  [get_bd_pins LPF_High_Lvl_Out/reset]
connect_bd_net -net vecAddNoOverflow_3_dataOut [get_bd_pins LPF_High_Lvl_Out/dataOut] [get_bd_pins dataOut]
connect_bd_net -net reg_bank_0_regOut08 [get_bd_pins dataIn1] [get_bd_pins Clipper/dataIn1]
connect_bd_net -net reg_bank_0_regOut09 [get_bd_pins dataIn2] [get_bd_pins Clipper/dataIn2]
connect_bd_net -net vecAddNoOverflow_2_dataOut [get_bd_pins A] [get_bd_pins High_Lvl_Gain/A]
connect_bd_net -net reg_bank_0_regOut06 [get_bd_pins B] [get_bd_pins High_Lvl_Gain/B]
connect_bd_net -net reg_bank_0_regOut07 [get_bd_pins dataShiftL] [get_bd_pins High_Lvl_Gain/dataShiftL]
connect_bd_net -net reg_bank_0_regOut11 [get_bd_pins dataInSwitch] [get_bd_pins DAC2Switch/dataInSwitch]
connect_bd_net -net clk_0_clk_125 [get_bd_pins clk1] [get_bd_pins DAC1Switch/clk1] [get_bd_pins DAC2Switch/clk1]
connect_bd_net -net reg_bank_0_regOut10 [get_bd_pins dataInSwitch1] [get_bd_pins DAC1Switch/dataInSwitch]

current_bd_instance /HighLevel/LPF_High_Lvl_Out
connect_bd_net [get_bd_pins vecSubNoOverflow_3/dataOut] [get_bd_pins vecShiftR_2/dataIn]
connect_bd_net [get_bd_pins vecShiftR_2/dataOut] [get_bd_pins vecAddNoOverflow_3/dataIn0]
connect_bd_net -net clkDivider_0_clk_o [get_bd_pins clk] \
  [get_bd_pins vecSubNoOverflow_3/clk] [get_bd_pins vecAddNoOverflow_3/clk] [get_bd_pins vecShiftR_2/clk]
connect_bd_net -net reg_bank_0_regOut12 [get_bd_pins dataShiftR] [get_bd_pins vecShiftR_2/dataShiftR]
connect_bd_net -net reg_bank_0_regOut00 [get_bd_pins reset] [get_bd_pins vecAddNoOverflow_3/reset] [get_bd_pins vecSubNoOverflow_3/reset]
connect_bd_net -net vecDiode_0_dataOut [get_bd_pins dataIn0] [get_bd_pins vecSubNoOverflow_3/dataIn0]
connect_bd_net [get_bd_pins vecAddNoOverflow_3/dataOut] \
  [get_bd_pins dataOut] [get_bd_pins vecAddNoOverflow_3/dataIn1] [get_bd_pins vecSubNoOverflow_3/dataIn1]

current_bd_instance /HighLevel/Clipper
connect_bd_net [get_bd_pins vecCompareGreaterEqu_0/dataOut] [get_bd_pins vecSwitch_0/dataInSwitch]
connect_bd_net [get_bd_pins vecSwitch_0/dataOut] [get_bd_pins vecSwitch_1/dataIn0] [get_bd_pins vecCompareSmallerEqu_0/dataIn0]
connect_bd_net [get_bd_pins vecCompareSmallerEqu_0/dataOut] [get_bd_pins vecSwitch_1/dataInSwitch]
connect_bd_net -net clkDivider_0_clk_o [get_bd_pins clk] \
  [get_bd_pins vecCompareGreaterEqu_0/clk] [get_bd_pins vecSwitch_1/clk] [get_bd_pins vecCompareSmallerEqu_0/clk] \
  [get_bd_pins vecSwitch_0/clk]
connect_bd_net [get_bd_pins dataIn0] [get_bd_pins vecCompareGreaterEqu_0/dataIn0] [get_bd_pins vecSwitch_0/dataIn0]
connect_bd_net -net reg_bank_0_regOut08 [get_bd_pins dataIn1] [get_bd_pins vecCompareGreaterEqu_0/dataIn1] [get_bd_pins vecSwitch_0/dataIn1]
connect_bd_net -net reg_bank_0_regOut09 [get_bd_pins dataIn2] [get_bd_pins vecSwitch_1/dataIn1] [get_bd_pins vecCompareSmallerEqu_0/dataIn1]
connect_bd_net [get_bd_pins vecSwitch_1/dataOut] [get_bd_pins dataOut]

current_bd_instance /HighLevel/High_Lvl_Gain
connect_bd_net [get_bd_pins mult_gen_2/P] [get_bd_pins xlslice_2/Din]
connect_bd_net [get_bd_pins xlslice_2/Dout] [get_bd_pins vecShiftL_1/dataIn]
connect_bd_net -net clkDivider_0_clk_o [get_bd_pins clk] [get_bd_pins vecShiftL_1/clk] [get_bd_pins mult_gen_2/CLK]
connect_bd_net -net vecAddNoOverflow_2_dataOut [get_bd_pins A] [get_bd_pins mult_gen_2/A]
connect_bd_net -net reg_bank_0_regOut06 [get_bd_pins B] [get_bd_pins mult_gen_2/B]
connect_bd_net -net reg_bank_0_regOut00 [get_bd_pins SCLR] [get_bd_pins mult_gen_2/SCLR]
connect_bd_net -net reg_bank_0_regOut07 [get_bd_pins dataShiftL] [get_bd_pins vecShiftL_1/dataShiftL]
connect_bd_net [get_bd_pins vecShiftL_1/dataOut] [get_bd_pins dataOut]

current_bd_instance /HighLevel/DAC2Switch
connect_bd_intf_net [get_bd_intf_pins data_o] [get_bd_intf_pins vecToStream16_1/data_o]
connect_bd_net [get_bd_pins vecSwitch_3/dataOut] [get_bd_pins vecToStream16_1/data]
connect_bd_net -net clkDivider_0_clk_o [get_bd_pins clk] [get_bd_pins vecSwitch_3/clk]
connect_bd_net -net reg_bank_0_regOut11 [get_bd_pins dataInSwitch] [get_bd_pins vecSwitch_3/dataInSwitch]
connect_bd_net -net xlconstant_1_dout [get_bd_pins dataIn0] [get_bd_pins vecSwitch_3/dataIn0]
connect_bd_net -net vecSwitch_1_dataOut [get_bd_pins dataIn1] [get_bd_pins vecSwitch_3/dataIn1]
connect_bd_net -net clk_0_clk_125 [get_bd_pins clk1] [get_bd_pins vecToStream16_1/clk]
connect_bd_net -net reg_bank_0_regOut00 [get_bd_pins resetn] [get_bd_pins vecToStream16_1/resetn]

current_bd_instance /HighLevel/DAC1Switch
connect_bd_intf_net [get_bd_intf_pins data_o] [get_bd_intf_pins vecToStream16_0/data_o]
connect_bd_net [get_bd_pins vecSwitch_2/dataOut] [get_bd_pins vecToStream16_0/data]
connect_bd_net -net clkDivider_0_clk_o [get_bd_pins clk] [get_bd_pins vecSwitch_2/clk]
connect_bd_net -net reg_bank_0_regOut10 [get_bd_pins dataInSwitch] [get_bd_pins vecSwitch_2/dataInSwitch]
connect_bd_net -net xlconstant_1_dout [get_bd_pins dataIn0] [get_bd_pins vecSwitch_2/dataIn0]
connect_bd_net -net vecSwitch_1_dataOut [get_bd_pins dataIn1] [get_bd_pins vecSwitch_2/dataIn1]
connect_bd_net -net clk_0_clk_125 [get_bd_pins clk1] [get_bd_pins vecToStream16_0/clk]
connect_bd_net -net reg_bank_0_regOut00 [get_bd_pins resetn] [get_bd_pins vecToStream16_0/resetn]

current_bd_instance /
connect_bd_intf_net [get_bd_intf_pins adc_0/adc_data_1] [get_bd_intf_pins Ichannel/data_i]
connect_bd_intf_net [get_bd_intf_ports FIXED_IO] [get_bd_intf_pins processing_system7_0/FIXED_IO]
connect_bd_intf_net [get_bd_intf_pins ps7_0_axi_periph/M02_AXI] [get_bd_intf_pins axi_gpio_0/S_AXI]
connect_bd_intf_net [get_bd_intf_pins processing_system7_0/M_AXI_GP0] [get_bd_intf_pins ps7_0_axi_periph/S00_AXI]
connect_bd_intf_net -intf_net vecToStream16_0_data_o [get_bd_intf_pins HighLevel/data_o1] [get_bd_intf_pins dac_0/dac_data_1]
connect_bd_intf_net [get_bd_intf_pins adc_0/adc_data_2] [get_bd_intf_pins Qchannel/data_i]
connect_bd_intf_net [get_bd_intf_ports DDR] [get_bd_intf_pins processing_system7_0/DDR]
connect_bd_intf_net [get_bd_intf_pins ps7_0_axi_periph/M00_AXI] [get_bd_intf_pins reg_bank_0/S00_AXI]
connect_bd_intf_net -intf_net vecToStream16_1_data_o [get_bd_intf_pins HighLevel/data_o] [get_bd_intf_pins dac_0/dac_data_2]
connect_bd_intf_net [get_bd_intf_pins axi_dma_0/M_AXI_S2MM] [get_bd_intf_pins axi_interconnect_0/S00_AXI]
connect_bd_intf_net [get_bd_intf_pins stream_ctrl_0/stream_i] [get_bd_intf_pins vecToStream16_0/data_o]
connect_bd_intf_net [get_bd_intf_pins axi_interconnect_0/M00_AXI] [get_bd_intf_pins processing_system7_0/S_AXI_HP0]
connect_bd_intf_net [get_bd_intf_pins stream_ctrl_0/stream_o] [get_bd_intf_pins axi_dma_0/S_AXIS_S2MM]
connect_bd_intf_net [get_bd_intf_pins ps7_0_axi_periph/M01_AXI] [get_bd_intf_pins axi_dma_0/S_AXI_LITE]
connect_bd_net -net clk_0_clk_125 [get_bd_pins clock/clk_125] \
  [get_bd_pins reg_bank_0/s00_axi_aclk] [get_bd_pins proc_sys_reset_0/slowest_sync_clk] [get_bd_pins ps7_0_axi_periph/ACLK] \
  [get_bd_pins ps7_0_axi_periph/S00_ACLK] [get_bd_pins ps7_0_axi_periph/M00_ACLK] \
  [get_bd_pins processing_system7_0/M_AXI_GP0_ACLK] [get_bd_pins watchdog_0/clk] [get_bd_pins dac_0/clk_125] \
  [get_bd_pins adc_0/clk_125] [get_bd_pins Ichannel/clk] [get_bd_pins Qchannel/clk] [get_bd_pins HighLevel/clk1] \
  [get_bd_pins axi_dma_0/m_axi_s2mm_aclk] [get_bd_pins axi_dma_0/s_axi_lite_aclk] [get_bd_pins axi_interconnect_0/ACLK] \
  [get_bd_pins axi_interconnect_0/S00_ACLK] [get_bd_pins axi_interconnect_0/M00_ACLK] [get_bd_pins axi_gpio_0/s_axi_aclk] \
  [get_bd_pins processing_system7_0/S_AXI_HP0_ACLK] [get_bd_pins ps7_0_axi_periph/M01_ACLK] \
  [get_bd_pins ps7_0_axi_periph/M02_ACLK] [get_bd_pins stream_ctrl_0/clk]
connect_bd_net -net clk_0_clk_250 [get_bd_pins clock/clk_250] [get_bd_pins dac_0/clk_250]
connect_bd_net -net clk_0_clk_250_m45 [get_bd_pins clock/clk_250_m45] [get_bd_pins dac_0/clk_250_m45]
connect_bd_net [get_bd_pins proc_sys_reset_0/peripheral_aresetn] \
  [get_bd_pins reg_bank_0/s00_axi_aresetn] [get_bd_pins ps7_0_axi_periph/S00_ARESETN] \
  [get_bd_pins ps7_0_axi_periph/M00_ARESETN] [get_bd_pins ps7_0_axi_periph/ARESETN] [get_bd_pins dac_0/resetn] \
  [get_bd_pins adc_0/resetn] [get_bd_pins axi_dma_0/axi_resetn] [get_bd_pins axi_interconnect_0/ARESETN] \
  [get_bd_pins axi_interconnect_0/S00_ARESETN] [get_bd_pins axi_interconnect_0/M00_ARESETN] \
  [get_bd_pins axi_gpio_0/s_axi_aresetn] [get_bd_pins ps7_0_axi_periph/M01_ARESETN] \
  [get_bd_pins ps7_0_axi_periph/M02_ARESETN] [get_bd_pins stream_ctrl_0/resetn]
connect_bd_net [get_bd_ports adc_clk_p_i] [get_bd_pins clock/adc_clk_p_i]
connect_bd_net [get_bd_ports adc_clk_n_i] [get_bd_pins clock/adc_clk_n_i]
connect_bd_net [get_bd_ports adc_data_1_i] [get_bd_pins adc_0/adc_data_1_i]
connect_bd_net [get_bd_ports adc_data_2_i] [get_bd_pins adc_0/adc_data_2_i]
connect_bd_net -net clk_0_adc_cdcs_o [get_bd_pins clock/adc_cdcs_o] [get_bd_ports adc_cdcs_o]
connect_bd_net [get_bd_pins dac_0/dac_clk_o] [get_bd_ports dac_clk_o]
connect_bd_net [get_bd_pins dac_0/dac_data_o] [get_bd_ports dac_data_o]
connect_bd_net [get_bd_pins dac_0/dac_rst_o] [get_bd_ports dac_rst_o]
connect_bd_net [get_bd_pins dac_0/dac_sel_o] [get_bd_ports dac_sel_o]
connect_bd_net [get_bd_pins dac_0/dac_wrt_o] [get_bd_ports dac_wrt_o]
connect_bd_net [get_bd_pins reg_bank_0/regOut00] \
  [get_bd_pins vecAddNoOverflow_2/reset] [get_bd_pins watchdog_0/resetn] [get_bd_pins clock/reset] \
  [get_bd_pins Ichannel/reset] [get_bd_pins Qchannel/reset] [get_bd_pins HighLevel/SCLR] [get_bd_pins vecToStream16_0/resetn]
connect_bd_net [get_bd_pins reg_bank_0/regOut01] [get_bd_pins Ichannel/dataShiftR] [get_bd_pins Qchannel/dataShiftR]
connect_bd_net -net clkDivider_0_clk_o [get_bd_pins clock/clk_o] \
  [get_bd_pins vecAddNoOverflow_2/clk] [get_bd_pins Ichannel/CLK1] [get_bd_pins Qchannel/CLK1] [get_bd_pins HighLevel/clk] \
  [get_bd_pins vecToStream16_0/clk]
connect_bd_net [get_bd_pins reg_bank_0/regOut05] [get_bd_pins Ichannel/A] [get_bd_pins Qchannel/A]
connect_bd_net [get_bd_pins reg_bank_0/regOut06] [get_bd_pins HighLevel/B]
connect_bd_net [get_bd_pins reg_bank_0/regOut07] [get_bd_pins HighLevel/dataShiftL]
connect_bd_net [get_bd_pins reg_bank_0/regOut08] [get_bd_pins HighLevel/dataIn1]
connect_bd_net [get_bd_pins reg_bank_0/regOut09] [get_bd_pins HighLevel/dataIn2]
connect_bd_net [get_bd_pins reg_bank_0/regOut10] [get_bd_pins HighLevel/dataInSwitch1]
connect_bd_net [get_bd_pins reg_bank_0/regOut11] [get_bd_pins HighLevel/dataInSwitch]
connect_bd_net [get_bd_pins reg_bank_0/regOut12] [get_bd_pins HighLevel/dataShiftR]
connect_bd_net -net vecAddNoOverflow_3_dataOut [get_bd_pins HighLevel/dataOut] [get_bd_pins reg_bank_0/regIn00]
connect_bd_net [get_bd_pins reg_bank_0/regOut13] [get_bd_pins Ichannel/dataShiftR1] [get_bd_pins Qchannel/dataShiftR1]
connect_bd_net -net Imult1_Dout [get_bd_pins Ichannel/Dout] [get_bd_pins vecAddNoOverflow_2/dataIn0]
connect_bd_net -net Qmult1_Dout [get_bd_pins Qchannel/Dout] [get_bd_pins vecAddNoOverflow_2/dataIn1]
connect_bd_net [get_bd_pins vecAddNoOverflow_2/dataOut] [get_bd_pins HighLevel/A]
connect_bd_net [get_bd_pins reg_bank_0/regOut03] [get_bd_pins Ichannel/B]
connect_bd_net [get_bd_pins reg_bank_0/regOut04] [get_bd_pins Qchannel/B]
connect_bd_net [get_bd_pins Ichannel/dataOut] [get_bd_pins reg_bank_0/regIn01]
connect_bd_net [get_bd_pins Qchannel/dataOut] [get_bd_pins reg_bank_0/regIn02]
connect_bd_net -net system_watchdog_o [get_bd_pins watchdog_0/watchdog_o] [get_bd_pins reg_bank_0/regIn03]
connect_bd_net [get_bd_pins processing_system7_0/FCLK_RESET0_N] [get_bd_pins proc_sys_reset_0/ext_reset_in]
connect_bd_net -net clk_0_locked [get_bd_pins clock/locked] [get_bd_pins proc_sys_reset_0/dcm_locked]
connect_bd_net [get_bd_pins reg_bank_0/regOut14] [get_bd_ports led_o] [get_bd_ports exp_n_io]
connect_bd_net [get_bd_pins HighLevel/dataOut1] [get_bd_pins vecToStream16_0/data]
connect_bd_net [get_bd_pins axi_gpio_0/gpio_io_o] [get_bd_pins stream_ctrl_0/trig]
connect_bd_net [get_bd_pins axi_gpio_0/gpio2_io_o] [get_bd_pins stream_ctrl_0/samples]
connect_bd_net [get_bd_pins reg_bank_0/regOut02] [get_bd_pins clock/divide2]
connect_bd_net [get_bd_pins reg_bank_0/regOut15] [get_bd_pins stream_ctrl_0/clk_divide]

# ---- address map ----
assign_bd_address -offset 0x00000000 -range 512M -target_address_space [get_bd_addr_spaces axi_dma_0/Data_S2MM] [get_bd_addr_segs processing_system7_0/S_AXI_HP0/HP0_DDR_LOWOCM]
assign_bd_address -offset 0x40400000 -range 64K -target_address_space [get_bd_addr_spaces processing_system7_0/Data] [get_bd_addr_segs axi_dma_0/S_AXI_LITE/Reg]
assign_bd_address -offset 0x41200000 -range 64K -target_address_space [get_bd_addr_spaces processing_system7_0/Data] [get_bd_addr_segs axi_gpio_0/S_AXI/Reg]
assign_bd_address -offset 0x43C00000 -range 64K -target_address_space [get_bd_addr_spaces processing_system7_0/Data] [get_bd_addr_segs reg_bank_0/S00_AXI/S00_AXI_reg]

validate_bd_design
save_bd_design
